# Altium schematic sheet Kajtuś-DSP_digital_out.SchDoc
size A4; DocumentNumber: 3; SheetNumber: 3; SheetTotal: 9
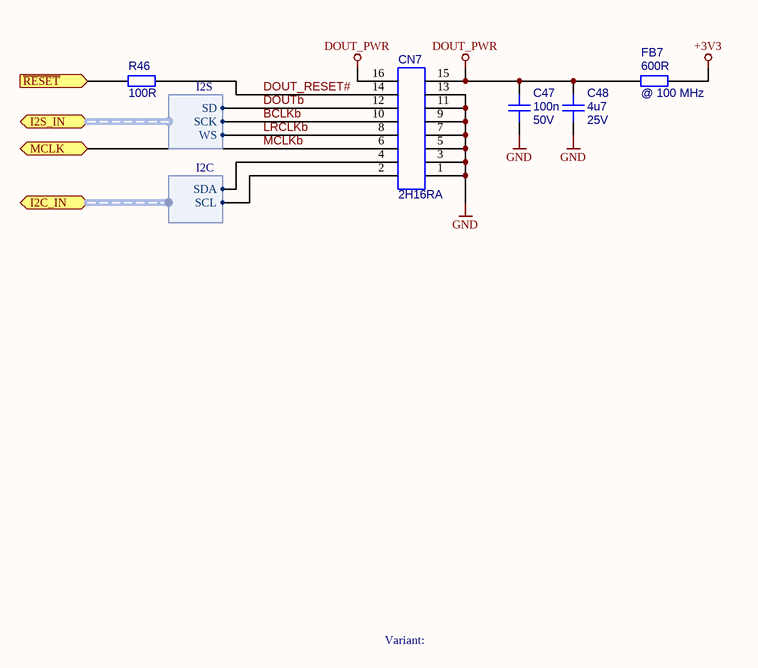
[diagram p0: Kajtuś-DSP_digital_out.SchDoc]

## Parts
C47  value 100n  Voltage: 50V  [C_0603_MA]  (hidden comment: C_0603_100n_50V_X7R)
C48  value 4u7  Voltage: 25V  [C_1206_MA]  (hidden comment: C_1206_4u7_25V_X7R)
CN7  2H16RA  [CN_2H16RA_WE_WR-PHD_61301621021]
FB7  value 600R  @ Frequency: @ 100 MHz  [R_0603_MA]  (hidden comment: FB_0603_PBY160808T-601Y_600R_1A)
R46  value 100R  [R_0603_MA]  (hidden comment: R_0603_100R_5%)

## Ports
I2C_IN (harness I2C), I2S_IN (harness I2S), MCLK, ~{RESET} (in)

## Harnesses
I2S: SD, SCK, WS
I2C: SDA, SCL

## Nets
+3V3: FB7.2
DOUT_PWR: C47.1 C48.1 CN7.15 CN7.16 FB7.1
GND: C47.2 C48.2 CN7.1 CN7.3 CN7.5 CN7.7 CN7.9 CN7.11 CN7.13
BCLKb: CN7.10 ; port I2S_IN.SCK
DOUT_RESET#: CN7.14 R46.2
DOUTb: CN7.12 ; port I2S_IN.SD
LRCLKb: CN7.8 ; port I2S_IN.WS
MCLKb: CN7.6 ; port MCLK
~{RESET}: R46.1 ; port ~{RESET}
NetCN7_2: CN7.2 ; port I2C_IN.SCL
NetCN7_4: CN7.4 ; port I2C_IN.SDA

## Notes on the sheet
- Variant:
- Title
- Size:
- Date:
- A4
- Number:
- Time:
- Revision:
- Sheet
- of
- File:

## Library data of the parts
C47 = C_0603_100n_50V_X7R: Kondensator ceramiczny SMD; Vendor: TME; Part Number: C_0603_100n_50V_X7R
C48 = C_1206_4u7_25V_X7R: Kondensator ceramiczny SMD; Manufacturer: AVX, KEMET; Vendor: TME; Part Number: C_1206_4u7_25V_X7R
CN7 = CN_2H16RA: Listwa kołkowa; Manufacturer: Ninigi; Vendor: TME; Part Number: CN_2H16RA; Value: 2H16RA
FB7 = FB_0603_PBY160808T-601Y_600R_1A: Koralik ferrytowy; Manufacturer: Yageo; Vendor: TME; Part Number: FB_0603_PBY160808T-601Y_600R_1A; Vendor Part Name: PBY160808T-601Y; Manufacturer Part Number: PBY160808T-601Y
R46 = R_0603_100R_5%: Rezystor SMD; Manufacturer: Royal Ohm; Vendor: TME; Tolerance: 5%; Part Number: R_0603_100R_5%